# Altium schematic sheet Power.SchDoc
size A4; SheetNumber: 4; SheetTotal: 6
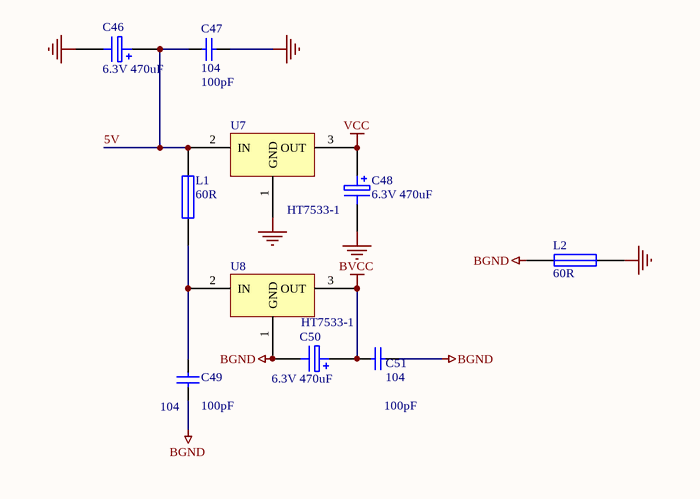
[diagram p0: Power.SchDoc]

## Parts
C46  6.3V 470uF  [CC5.05.4]
C47  104  value 100pF  [0603C]
C48  6.3V 470uF  [CC5.05.4]
C49  104  value 100pF  [0603C]
C50  6.3V 470uF  [CC5.05.4]
C51  104  value 100pF  [0603C]
L1  60R  [0603]
L2  60R  [0603]
U7  HT7533-1  [SOT89_M]
U8  HT7533-1  [SOT89_M]

## Nets
BGND: C49.2 C50.2 C51.1 L2.1 U8.1(GND)
BVCC: C50.1 C51.2 U8.3(OUT)
GND: C46.2 C47.1 C48.2 L2.2 U7.1(GND)
VCC: C48.1 U7.3(OUT)
5V: C46.1 C47.2 L1.1 U7.2(IN)
NetC49_1: C49.1 L1.2 U8.2(IN)

## Library data of the parts
C46 C48 C50 = ELECTRO1: Electrolytic Capacitor
C47 C49 C51 = CAP: Capacitor; Published: 8-Jun-2000; LatestRevisionDate: 17-Jul-2002; LatestRevisionNote: Re-released for DXP Platform.; PackageReference: RAD-0.3; Publisher: Altium Limited; PackageDescription: Radial Cap, Thru-Hole; 2 Leads; 0.3 in Pin Spacing
L1 L2 = FUSE1: Fuse